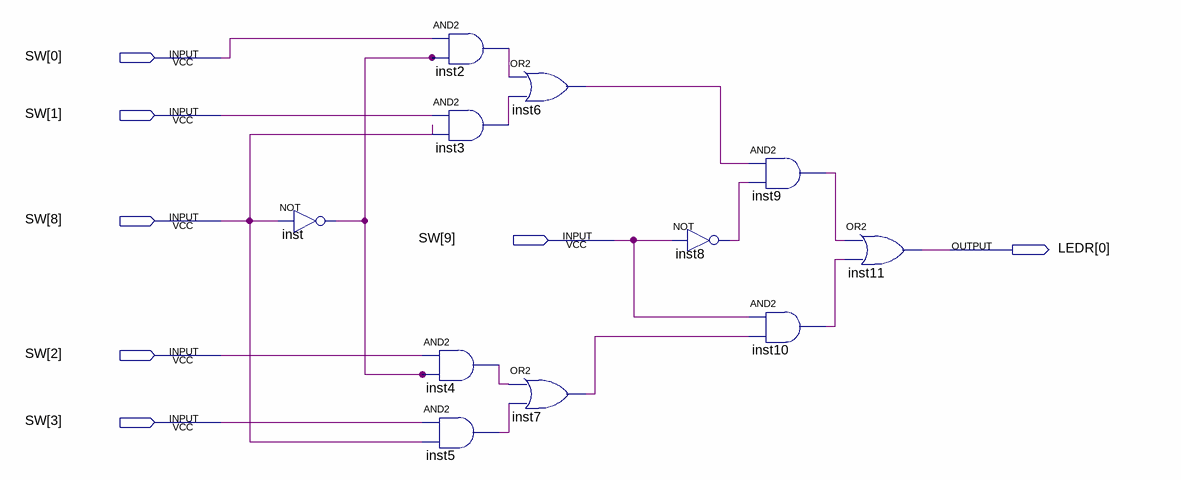
[diagram p0: schematic sheet]
// Quartus schematic lab_2_part2.bdf as structural Verilog: 11 symbols, 7 pins
module lab_2_part2 (
  input  [9:0] SW,
  output [0:0] LEDR
);

  wire inst2_out, inst3_out, inst4_out, inst5_out, inst6_out, inst7_out, inst8_out, inst9_out, inst10_out,
       inst_out;

  not inst (inst_out, SW[8]);
  and inst2 (inst2_out, SW[0], inst_out);
  and inst3 (inst3_out, SW[1], SW[8]);
  and inst4 (inst4_out, SW[2], inst_out);
  and inst5 (inst5_out, SW[3], SW[8]);
  or inst6 (inst6_out, inst2_out, inst3_out);
  or inst7 (inst7_out, inst4_out, inst5_out);
  not inst8 (inst8_out, SW[9]);
  and inst9 (inst9_out, inst6_out, inst8_out);
  and inst10 (inst10_out, SW[9], inst7_out);
  or inst11 (LEDR[0], inst9_out, inst10_out);
endmodule
